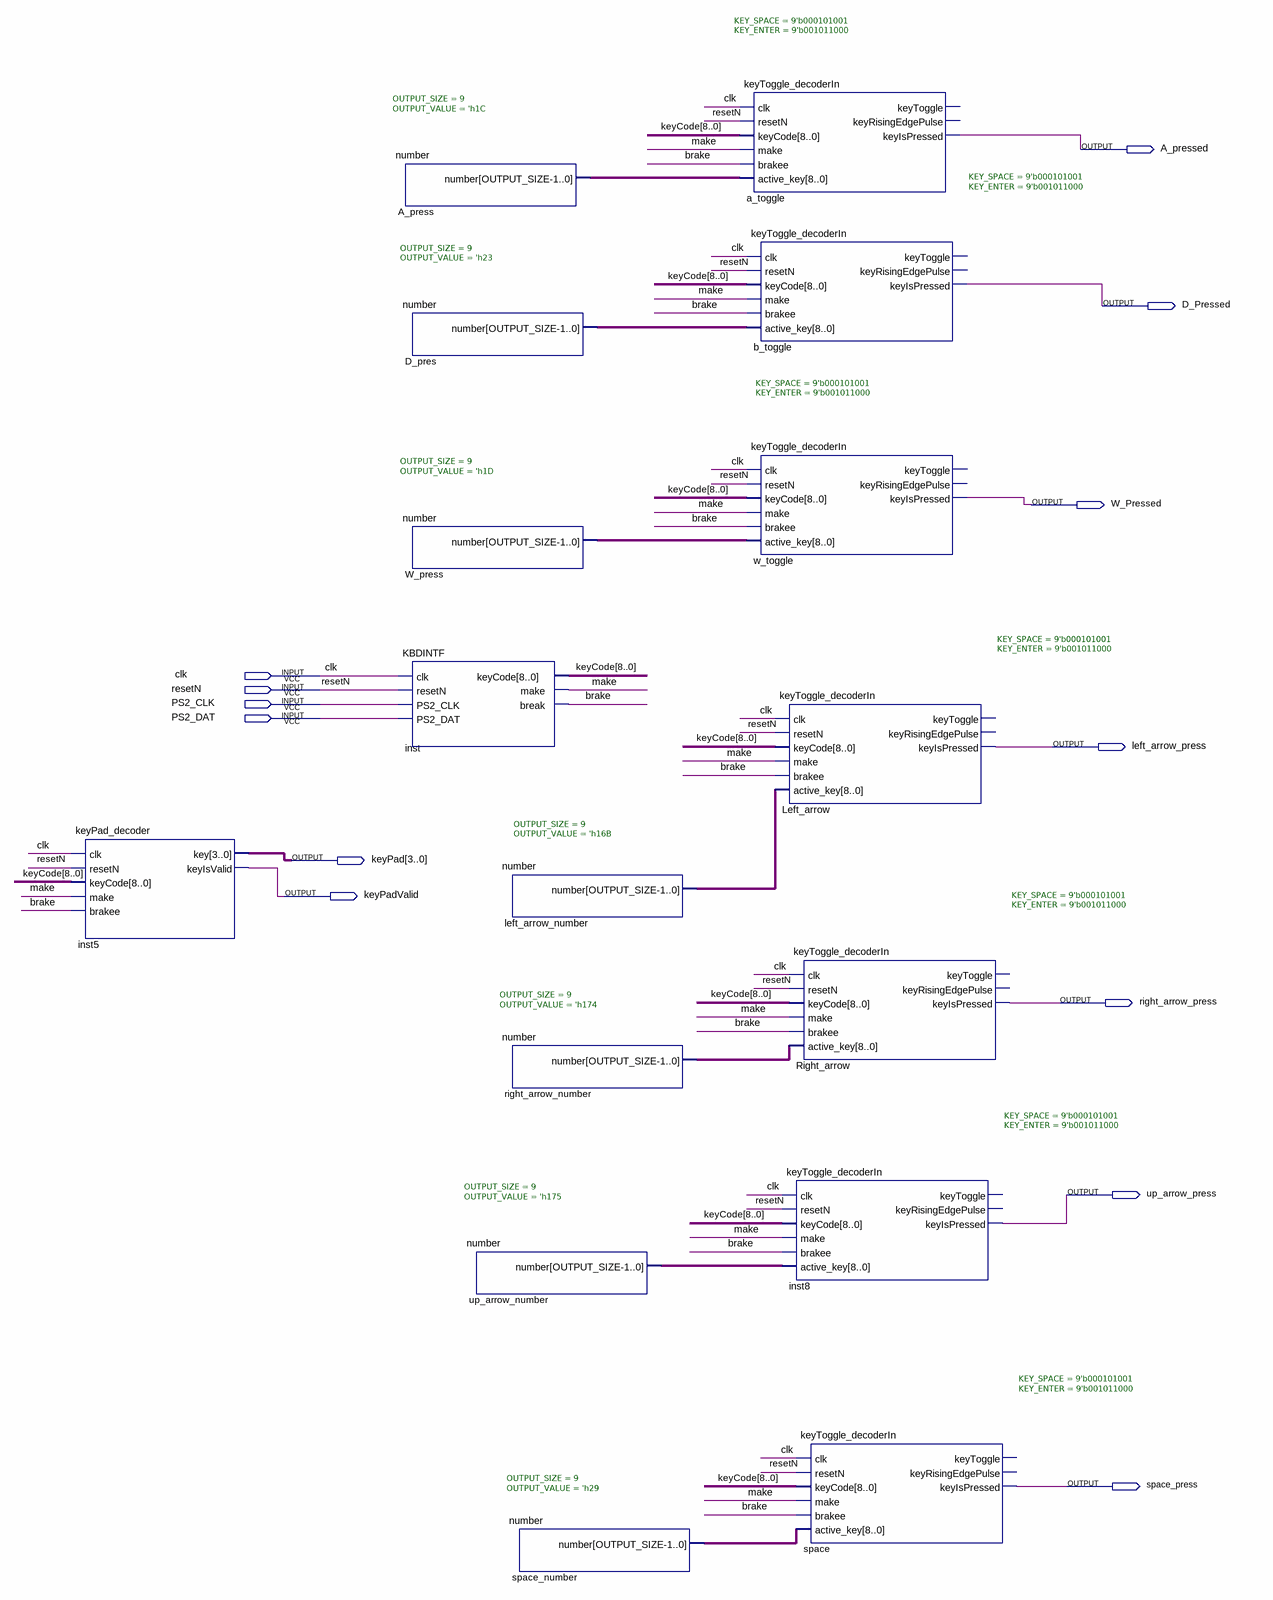
[diagram p0: schematic sheet]
// Quartus schematic TOP_KBD.bdf as structural Verilog: 16 symbols, 13 pins
module TOP_KBD (
  input  clk,
  input  resetN,
  input  PS2_CLK,
  input  PS2_DAT,
  output A_pressed,
  output D_Pressed,
  output W_Pressed,
  output left_arrow_press,
  output [3:0] keyPad,
  output keyPadValid,
  output right_arrow_press,
  output up_arrow_press,
  output space_press
);

  wire brake, make;
  wire [8:0] A_press_number, D_pres_number, keyCode, left_arrow_number_number, right_arrow_number_number,
       space_number_number, up_arrow_number_number, W_press_number;

  keyPad_decoder inst5 (
    .clk(clk), .resetN(resetN), .keyCode(keyCode), .make(make), .brakee(brake), .key(keyPad),
    .keyIsValid(keyPadValid));
  number #(.OUTPUT_SIZE(9), .OUTPUT_VALUE('h1C)) A_press (.number(A_press_number));
  number #(.OUTPUT_SIZE(9), .OUTPUT_VALUE('h23)) D_pres (.number(D_pres_number));
  number #(.OUTPUT_SIZE(9), .OUTPUT_VALUE('h1D)) W_press (.number(W_press_number));
  KBDINTF inst (
    .clk(clk), .resetN(resetN), .PS2_CLK(PS2_CLK), .PS2_DAT(PS2_DAT), .keyCode(keyCode), .make(make),
    .\break (brake));
  number #(.OUTPUT_SIZE(9), .OUTPUT_VALUE('h175)) up_arrow_number (.number(up_arrow_number_number));
  number #(.OUTPUT_SIZE(9), .OUTPUT_VALUE('h16B)) left_arrow_number (.number(left_arrow_number_number));
  number #(.OUTPUT_SIZE(9), .OUTPUT_VALUE('h174)) right_arrow_number (.number(right_arrow_number_number));
  number #(.OUTPUT_SIZE(9), .OUTPUT_VALUE('h29)) space_number (.number(space_number_number));
  keyToggle_decoderIn #(.KEY_SPACE(9'b000101001), .KEY_ENTER(9'b001011000)) a_toggle (
    .clk(clk), .resetN(resetN), .keyCode(keyCode), .make(make), .brakee(brake), .active_key(A_press_number),
    .keyIsPressed(A_pressed));  // open: keyToggle, keyRisingEdgePulse
  keyToggle_decoderIn #(.KEY_SPACE(9'b000101001), .KEY_ENTER(9'b001011000)) b_toggle (
    .clk(clk), .resetN(resetN), .keyCode(keyCode), .make(make), .brakee(brake), .active_key(D_pres_number),
    .keyIsPressed(D_Pressed));  // open: keyToggle, keyRisingEdgePulse
  keyToggle_decoderIn #(.KEY_SPACE(9'b000101001), .KEY_ENTER(9'b001011000)) w_toggle (
    .clk(clk), .resetN(resetN), .keyCode(keyCode), .make(make), .brakee(brake), .active_key(W_press_number),
    .keyIsPressed(W_Pressed));  // open: keyToggle, keyRisingEdgePulse
  keyToggle_decoderIn #(.KEY_SPACE(9'b000101001), .KEY_ENTER(9'b001011000)) Left_arrow (
    .clk(clk), .resetN(resetN), .keyCode(keyCode), .make(make), .brakee(brake),
    .active_key(left_arrow_number_number), .keyIsPressed(left_arrow_press));  // open: keyToggle, keyRisingEdgePulse
  keyToggle_decoderIn #(.KEY_SPACE(9'b000101001), .KEY_ENTER(9'b001011000)) Right_arrow (
    .clk(clk), .resetN(resetN), .keyCode(keyCode), .make(make), .brakee(brake),
    .active_key(right_arrow_number_number), .keyIsPressed(right_arrow_press));  // open: keyToggle, keyRisingEdgePulse
  keyToggle_decoderIn #(.KEY_SPACE(9'b000101001), .KEY_ENTER(9'b001011000)) inst8 (
    .clk(clk), .resetN(resetN), .keyCode(keyCode), .make(make), .brakee(brake),
    .active_key(up_arrow_number_number), .keyIsPressed(up_arrow_press));  // open: keyToggle, keyRisingEdgePulse
  keyToggle_decoderIn #(.KEY_SPACE(9'b000101001), .KEY_ENTER(9'b001011000)) space (
    .clk(clk), .resetN(resetN), .keyCode(keyCode), .make(make), .brakee(brake),
    .active_key(space_number_number), .keyIsPressed(space_press));  // open: keyToggle, keyRisingEdgePulse
endmodule
